# Altium schematic sheet SM_ME0005V2.6_20161210.SchDoc
size A3
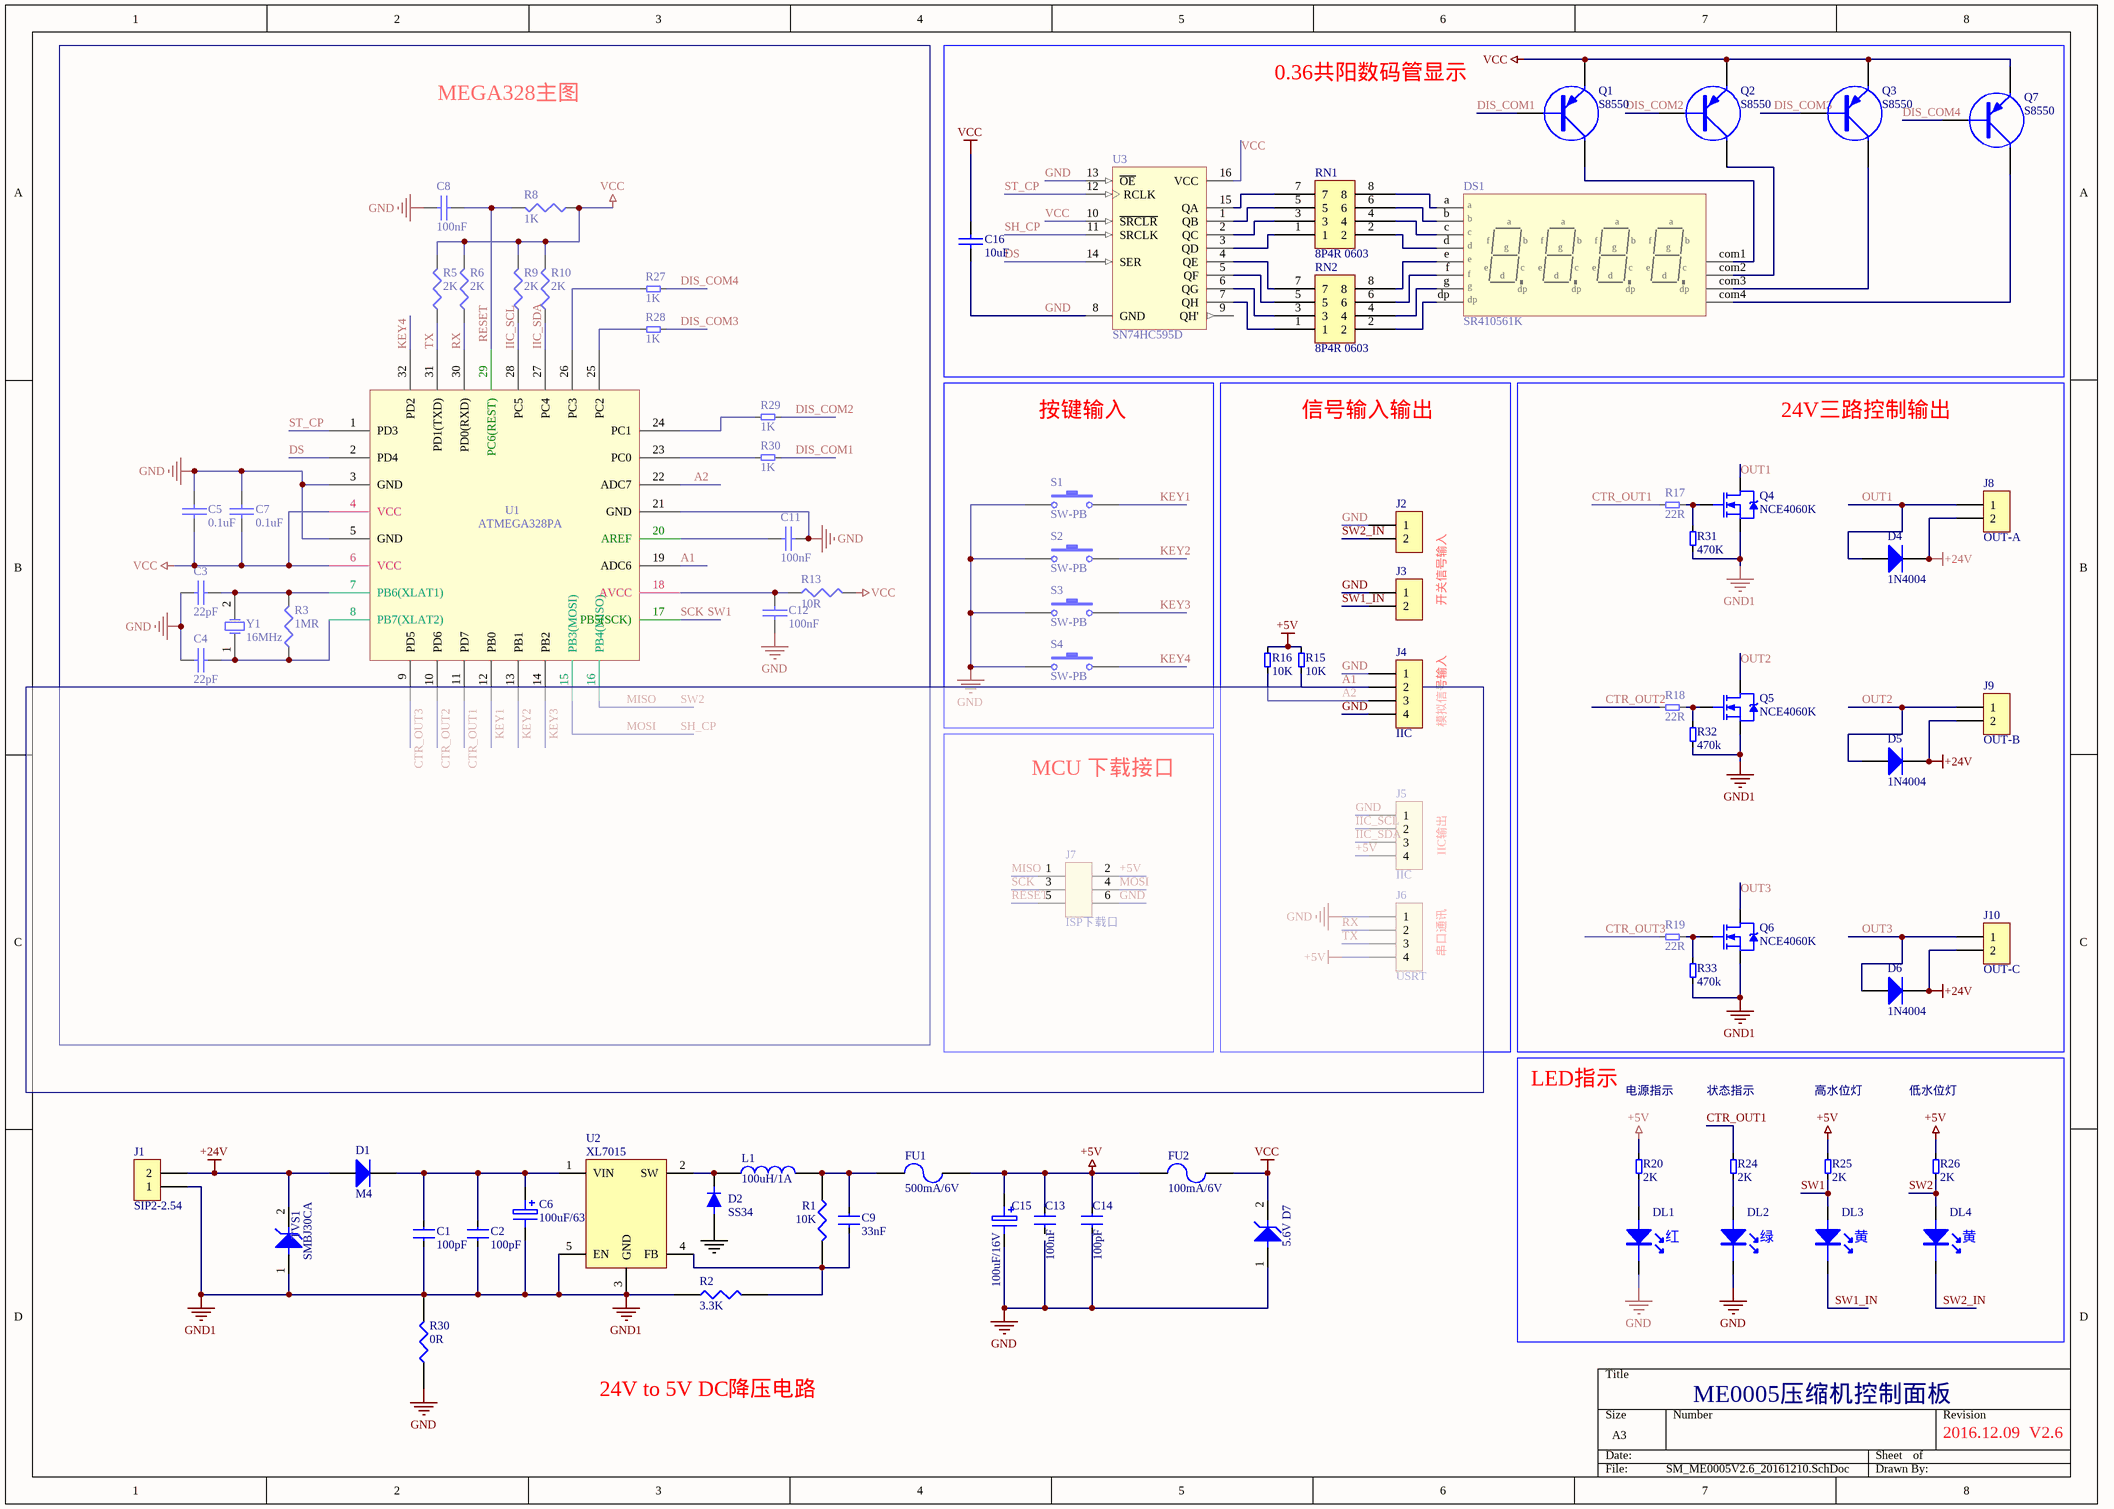
[diagram p0: SM_ME0005V2.6_20161210.SchDoc]

## Parts
(Parts that share a designator on the sheet are numbered #1, #2 ... from top to bottom, then left to right.)
C1  100pF  [0805C]
C2  100pF  [0805C]
C3  22pF  [0805c]
C4  22pF  [0805c]
C5  0.1uF  [0805c]
C6  100uF/63V_E  [SMD-EC-F8]
C7  0.1uF  [0805c]
C8  100nF  [0805c]
C9  33nF  [0805C]
C11  100nF  [0805c]
C12  100nF  [0805c]
C13  100nF  [0805C]
C14  100pF  [0805C]
C15  100uF/16V  [SMD-EC-F6.3]
C16  10uF  [0805c]
D1  M4  [D7227]
D2  SS34  [DIODE-SMA]
D4  1N4004  [D7227]
D5  1N4004  [D7227]
D6  1N4004  [D7227]
D7  5.6V  [LC-SMA(DO-214AC)_S4]
DL1  红  [LED-3]
DL2  绿  [LED-3]
DL3  黄  [LED-3]
DL4  黄  [LED-3]
DS1  SR410561K  [SR410361]
FU1  500mA/6V  [F0805]
FU2  100mA/6V  [F0805]
J1  SIP2-2.54  [CH3.96-2P]
J2  SIP2-2.54  [SIP-2L]  (value not drawn)
J3  SIP2-2.54  [SIP-2L]  (value not drawn)
J4  IIC  [SIP-4L]
J5  IIC  [SIP-4L]
J6  USRT  [SIP-4L]
J7  ISP下载口  [DIP6-2.54]
J8  OUT-A  [CH3.96-2P]
J9  OUT-B  [CH3.96-2P]
J10  OUT-C  [CH3.96-2P]
L1  100uH/1A  [LS1]
Q1  S8550  [SOT-23_B]
Q2  S8550  [SOT-23_B]
Q3  S8550  [SOT-23_B]
Q4  NCE4060K  [TO-252-3S]
Q5  NCE4060K  [TO-252-3S]
Q6  NCE4060K  [TO-252-3S]
Q7  S8550  [SOT-23_B]
R1  10K  [0805R]
R2  3.3K  [0805R]
R3  1MR  [0805R]
R5  2K  [0805R]
R6  2K  [0805R]
R8  1K  [0805R]
R9  2K  [0805R]
R10  2K  [0805R]
R13  10R  [0805R]
R15  10K  [0805R]
R16  10K  [0805R]
R17  22R  [0805R]
R18  22R  [0805R]
R19  22R  [0805R]
R20  2K  [0805R]
R24  2K  [0805R]
R25  2K  [0805R]
R26  2K  [0805R]
R27  1K  [0805R]
R28  1K  [0805R]
R29  1K  [0805R]
R30#1  1K  [0805R]
R30#2  0R  [0805R]
R31  470K  [0805R]
R32  470k  [0805R]
R33  470k  [0805R]
RN1  8P4R 0603  [8P4R_0603]
RN2  8P4R 0603  [8P4R_0603]
S1  SW-PB  [BUTTON_SMT_6*6]
S2  SW-PB  [BUTTON_SMT_6*6]
S3  SW-PB  [BUTTON_SMT_6*6]
S4  SW-PB  [BUTTON_SMT_6*6]
TVS1  SMBJ30CA  [LC-SMA(DO-214AC)_S5]
U1  ATMEGA328PA  [TQFP32]
U2  XL7015  [TO-252-5L]
U3  SN74HC595D  [SO-16N]
Y1  16MHz  [SMT5032]

## Blocks framed on the sheet
MEGA328主图: C3-C5 C7 C8 C11 C12 R3 R5 R6 R8-R10 R13 R27-R29 R30#1 U1 Y1
0.36共阳数码管显示: C16 DS1 Q1-Q3 Q7 RN1 RN2 U3
按键输入: S1-S4
信号输入输出: J2-J6 R15 R16
24V三路控制输出: D4-D6 J8-J10 Q4-Q6 R17-R19 R31-R33
MCU 下载接口: J7
LED指示: DL1-DL4 R20 R24-R26

## Nets
+5V: C13.1 C14.1 C15.1 FU1.2 FU2.1 J5.4 J6.4 J7.2 R15.2 R16.2 R20.2 R25.2 R26.2
+24V: D1.A D4.K D5.K D6.K J1.2 J8.2 J9.2 J10.2 TVS1.2(K)
GND: C3.1 C4.1 C5.1 C7.1 C8.1 C11.2 C12.1 C14.2 C15.2 C16.1 D2.1(A) D7.1(A) DL1.K DL2.K J2.1 J3.1 J4.1 J4.4 J5.1 J6.1 J7.6 R30#2.1 S1.1 S2.1 S3.1 S4.1 U1.3(GND) U1.5(GND) U1.21(GND) U3.8(GND) U3.13(~{OE})
GND1: C1.2 C2.2 C6.2 J1.1 Q4.3(S) Q5.3(S) Q6.3(S) R2.1 R30#2.2 R31.1 R32.1 R33.1 TVS1.1(A) U2.3(GND) U2.5(EN)
VCC: C5.2 C7.2 C16.2 D7.2(K) FU2.2 Q1.2(E) Q2.2(E) Q3.2(E) Q7.2(E) R5.2 R6.2 R8.1 R9.2 R10.2 R13.2 U1.4(VCC) U1.6(VCC) U3.10(~{SRCLR}) U3.16(VCC)
A1: J4.2 R15.1 U1.19(ADC6)
A2: J4.3 R16.1 U1.22(ADC7)
CTR_OUT1: R17.1 R24.2 U1.11(PD7)
CTR_OUT2: R18.1 U1.10(PD6)
CTR_OUT3: R19.1 U1.9(PD5)
DIS_COM1: Q1.1(B) R30#1.1
DIS_COM2: Q2.1(B) R29.1
DIS_COM3: Q3.1(B) R28.1
DIS_COM4: Q7.1(B) R27.1
DS: U1.2(PD4) U3.14(SER)
IIC_SCL: J5.2 R9.1 U1.28(PC5)
IIC_SDA: J5.3 R10.1 U1.27(PC4)
KEY1: S1.2 U1.12(PB0)
KEY2: S2.2 U1.13(PB1)
KEY3: S3.2 U1.14(PB2)
KEY4: S4.2 U1.32(PD2)
MISO: DL4.A J7.1 R26.1 U1.16(PB4(MISO))  [also labelled SW2]
MOSI: J7.4 U1.15(PB3(MOSI)) U3.11(SRCLK)  [also labelled SH_CP]
OUT1: D4.A J8.1 Q4.2(D)
OUT2: D5.A J9.1 Q5.2(D)
OUT3: D6.A J10.1 Q6.2(D)
RESET: C8.2 J7.5 R8.2 U1.29(PC6(REST))
RX: J6.2 R6.1 U1.30(PD0(RXD))
SCK: DL3.A J7.3 R25.1 U1.17(PB5(SCK))  [also labelled SW1]
ST_CP: U1.1(PD3) U3.12(RCLK)
SW1_IN: DL3.K J3.2
SW2_IN: DL4.K J2.2
TX: J6.3 R5.1 U1.31(PD1(TXD))
NetC1_1: C1.1 C2.1 C6.1 D1.K U2.1(VIN)
NetC3_2: C3.2 R3.2 U1.7(PB6(XLAT1)) Y1.2(OSC2)
NetC4_2: C4.2 R3.1 U1.8(PB7(XLAT2)) Y1.1(OSC1)
NetC9_1: C9.1 FU1.1 L1.2 R1.1
NetC9_2: C9.2 R1.2 R2.2 U2.4(FB)
NetC11_1: C11.1 U1.20(AREF)
NetC12_2: C12.2 R13.1 U1.18(AVCC)
NetD2_2: D2.2(K) L1.1 U2.2(SW)
NetDL1_A: DL1.A R20.1
NetDL2_A: DL2.A R24.1
NetDS1_a: DS1.a RN1.8
NetDS1_b: DS1.b RN1.6
NetDS1_c: DS1.c RN1.4
NetDS1_com1: DS1.com1 Q1.3(C)
NetDS1_com2: DS1.com2 Q2.3(C)
NetDS1_com3: DS1.com3 Q3.3(C)
NetDS1_com4: DS1.com4 Q7.3(C)
NetDS1_d: DS1.d RN1.2
NetDS1_dp: DS1.dp RN2.2
NetDS1_e: DS1.e RN2.8
NetDS1_f: DS1.f RN2.6
NetDS1_g: DS1.g RN2.4
NetQ4_1: Q4.1(G) R17.2 R31.2
NetQ5_1: Q5.1(G) R18.2 R32.2
NetQ6_1: Q6.1(G) R19.2 R33.2
NetR27_2: R27.2 U1.26(PC3)
NetR28_2: R28.2 U1.25(PC2)
NetR29_2: R29.2 U1.24(PC1)
NetR30#1_2: R30#1.2 U1.23(PC0)
NetRN1_1: RN1.1 U3.3(QD)
NetRN1_3: RN1.3 U3.2(QC)
NetRN1_5: RN1.5 U3.1(QB)
NetRN1_7: RN1.7 U3.15(QA)
NetRN2_1: RN2.1 U3.7(QH)
NetRN2_3: RN2.3 U3.6(QG)
NetRN2_5: RN2.5 U3.5(QF)
NetRN2_7: RN2.7 U3.4(QE)

Not connected (* = marked no-connect by the designer): C13 2; U3 9(QH')

## Notes on the sheet
- 开关信号输入
- (near J4) 模拟信号输入
- (near J5) IIC输出
- (near J6) 串口通讯
- 电源指示
- 状态指示
- 高水位灯
- 低水位灯
- 24V to 5V DC降压电路
- ME0005压缩机控制面板
- 2016.12.09  V2.6

## Library data of the parts
C1 C2 C9 C13 C14 = 0.01UF: CCX85-103
C3-C5 C7 C8 C11 C12 C16 = CAP: Capacitor
C6 C15 = 22UF/35V_E: CCER1-226S035
D1 D4-D6 = Diode_2: Default Diode; Published: 8-Jun-2000; LatestRevisionDate: 17-Jul-2002; LatestRevisionNote: Re-released for DXP Platform.; PackageVersion: Sep-1996; PackageReference: SMC; Publisher: Altium Limited; PackageDescription: DO-214-AB/SMC; 2 C-Bend Leads; Body 7.9 x 5.9 mm, inc. leads (LxW); Code_JEDEC: DO-214-AB
D2 = DIODE
D7 TVS1 = DIODE2
DL1-DL4 = L-7113SRD-D: CP-L-7113SRD-D
DS1 = SR410561K: CP-SR410561K
FU1 FU2 = FUSE2: Fuse
J1-J3 = SIP2-2.54: CN-SIP2-2.54
J4-J6 = SIP4-2.54: CN-SIP4-2.54
J7 = DIP6-2.54: CN-DIP6-2.54
J8-J10 = CON2: Connector
L1 = INDUCTOR
Q1-Q3 Q7 = PNP: PNP Transistor
Q4-Q6 = NCE4060K: NMOSFET
R1 R2 R30#2 = RES1
R3 R5 R6 R8-R10 R13 = Res3: Resistor; Published: 8-Jun-2000; LatestRevisionDate: 29-May-2009; LatestRevisionNote: IPC-7351 Footprint Added.; PackageReference: J1-0603; Publisher: Altium Limited; PackageDescription: Chip Resistor
R15-R20 R24-R29 R30#1 R31-R33 = 1K: CR85-102J
S1-S4 = SW-PB: Switch; Published: 24-Mar-1999; LatestRevisionDate: 17-Jul-2002; LatestRevisionNote: Re-released for DXP Platform.; PackageReference: SPST-2; Publisher: Altium Limited
U3 = SN74HC595D: 8-Bit Shift Register with 3-State Output Registers; Published: 8-Jun-2000; LatestRevisionDate: 13-Apr-2006; LatestRevisionNote: IPC-7351 Footprint Added.; DatasheetVersion: May-1997; PackageVersion: Jan-1998; PackageReference: D016; Publisher: Altium Limited; PackageDescription: 16-Pin Small Outline Integrated Circuit 1.27 mm Pitch; Code_IPC: SOIC127P600-16; ComponentLink1Description: Manufacturer Link; ComponentLink1URL: http://www.ti.com/; ComponentLink2Description: Datasheet; ComponentLink2URL: http://www-s.ti.com/sc/ds/sn74hc595.pdf
Y1 = XTAL: Crystal Oscillator; Published: 8-Jun-2000; LatestRevisionDate: 17-Jul-2002; LatestRevisionNote: Re-released for DXP Platform.; PackageReference: R38; Publisher: Altium Limited; PackageDescription: Crystal, Thru-Hole; 2 Leads; Body 3.1 x 8.2 mm (Dia.xH)